# EAGLE design watch_rev3 (EAGLE 6.5.0)
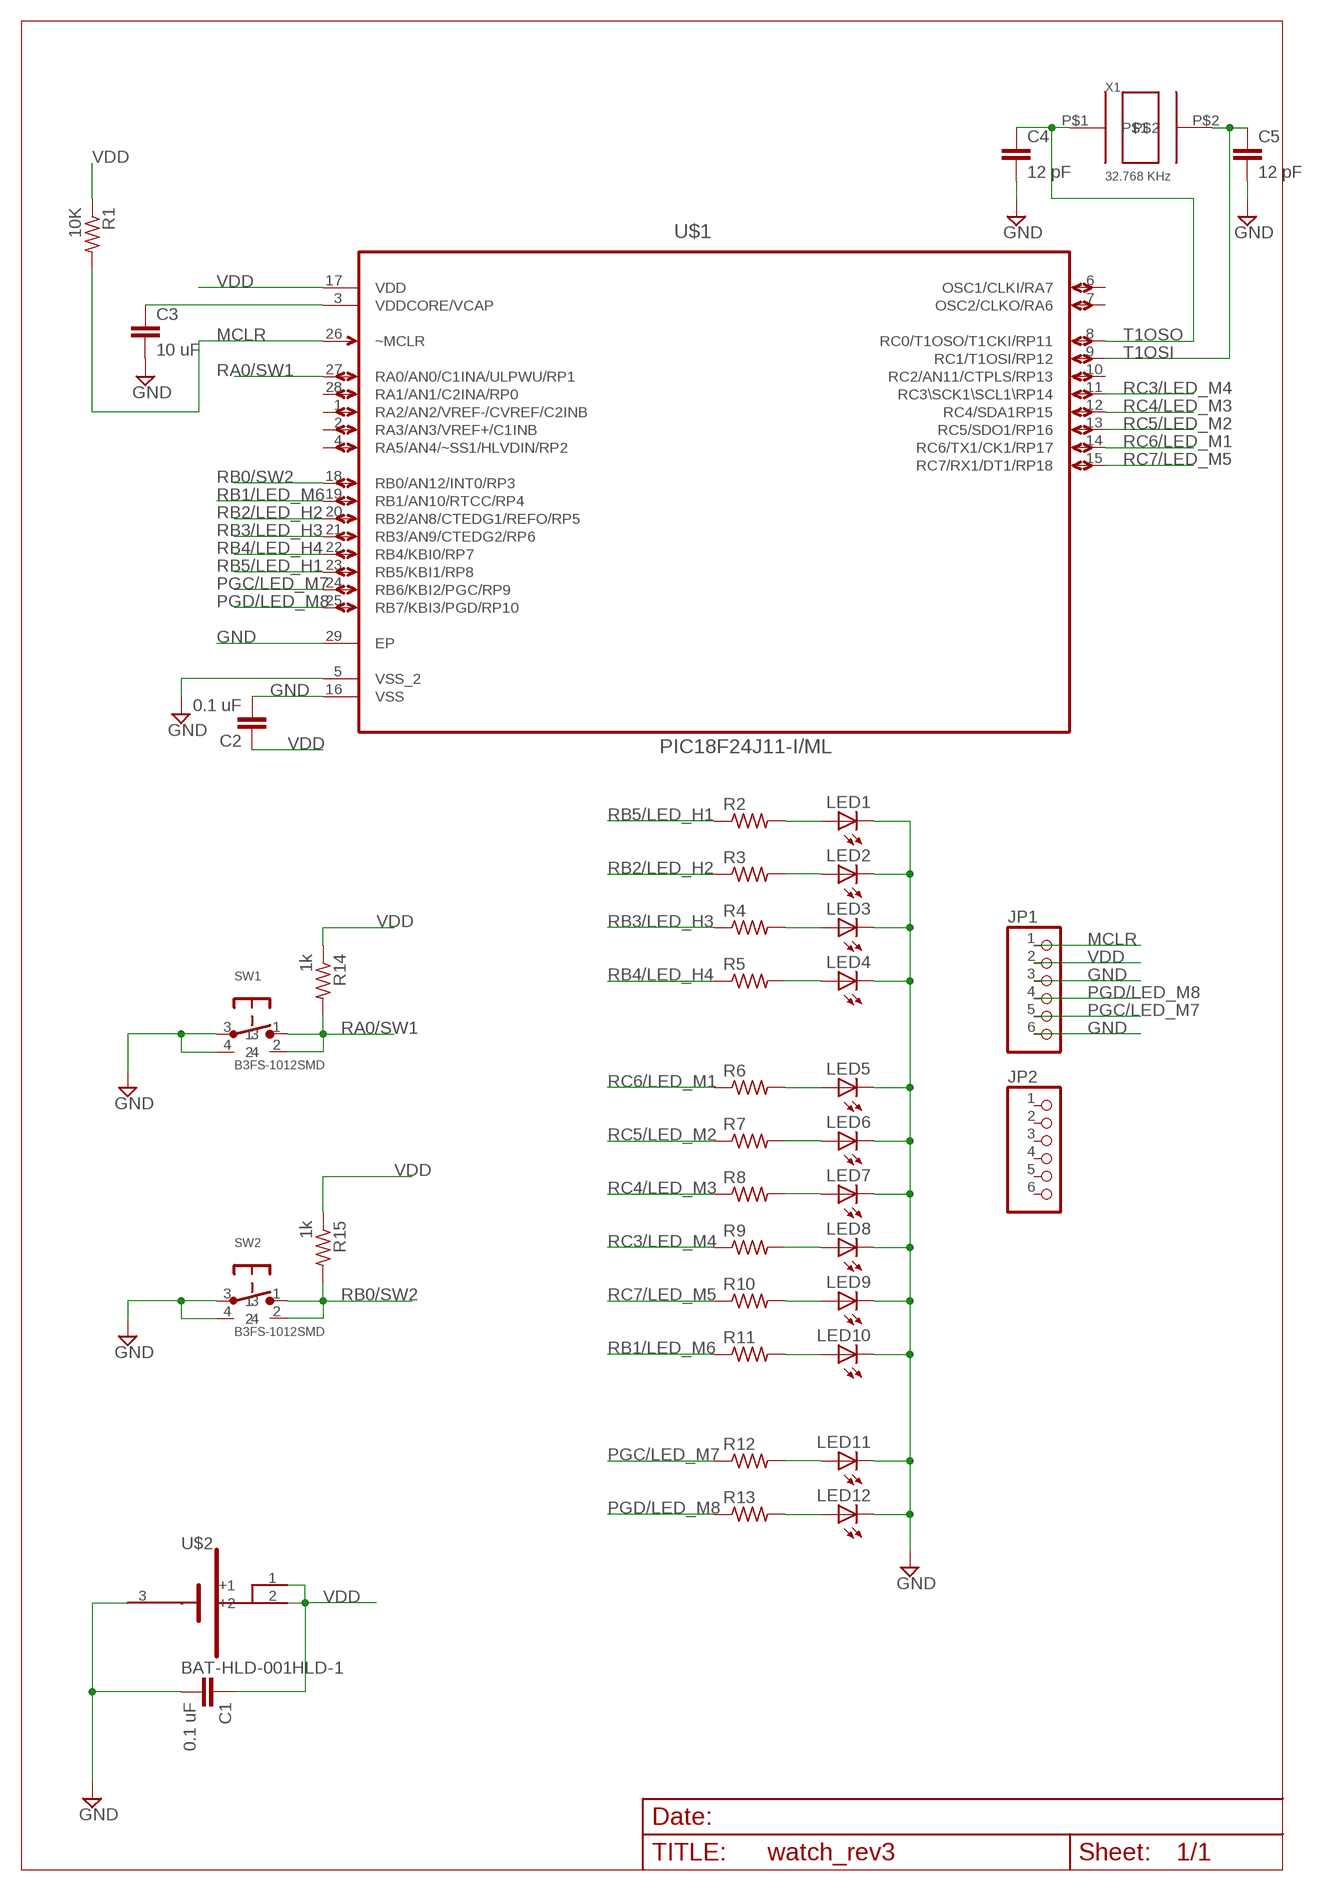
[diagram p0: schematic, sheet 1]

## Parts
C1  0.1 uF  C-EUC0603  [C0603]
C2  0.1 uF  C-EUC0603  [C0603]
C3  10 uF  C-EUC0603  [C0603]
C4  12 pF  C-EUC0603  [C0603]
C5  12 pF  C-EUC0603  [C0603]
JP1  PINHD-1X6  [1X06]
JP2  PINHD-1X6  [1X06]
LED1  LEDCHIPLED_0603  [CHIPLED_0603]
LED2  LEDCHIPLED_0603  [CHIPLED_0603]
LED3  LEDCHIPLED_0603  [CHIPLED_0603]
LED4  LEDCHIPLED_0603  [CHIPLED_0603]
LED5  LEDCHIPLED_0603  [CHIPLED_0603]
LED6  LEDCHIPLED_0603  [CHIPLED_0603]
LED7  LEDCHIPLED_0603  [CHIPLED_0603]
LED8  LEDCHIPLED_0603  [CHIPLED_0603]
LED9  LEDCHIPLED_0603  [CHIPLED_0603]
LED10  LEDCHIPLED_0603  [CHIPLED_0603]
LED11  LEDCHIPLED_0603  [CHIPLED_0603]
LED12  LEDCHIPLED_0603  [CHIPLED_0603]
R1  10K  R-US_R0603  [R0603]
R2  R-US_R0603  [R0603]
R3  R-US_R0603  [R0603]
R4  R-US_R0603  [R0603]
R5  R-US_R0603  [R0603]
R6  R-US_R0603  [R0603]
R7  R-US_R0603  [R0603]
R8  R-US_R0603  [R0603]
R9  R-US_R0603  [R0603]
R10  R-US_R0603  [R0603]
R11  R-US_R0603  [R0603]
R12  R-US_R0603  [R0603]
R13  R-US_R0603  [R0603]
R14  1k  R-US_R0603  [R0603]
R15  1k  R-US_R0603  [R0603]
SW1  B3FS-1012SMD  [B3FS-1012]
SW2  B3FS-1012SMD  [B3FS-1012]
U$1  PIC18F24J11-I/ML  [QFN65P600X600X100-29N]
U$2  BAT-HLD-001HLD-1  [BAT-HLD-001]
X1  32.768 KHz  ST3215SB32768E0HPWBB  [XTAL_3.2X1.5]

## Nets
GND: C1.2 C2.2 C3.2 C4.2 C5.2 JP1.3 JP1.6 LED1.C LED2.C LED3.C LED4.C LED5.C LED6.C LED7.C LED8.C LED9.C LED10.C LED11.C LED12.C SW1.3 SW1.4 SW2.3 SW2.4 U$1.5(VSS_2) U$1.16(VSS) U$1.29(EP) U$2.3(-)
MCLR: JP1.1 R1.2 U$1.26(~MCLR)
N$2: LED1.A R2.2
N$3: LED2.A R3.2
N$4: C3.1 U$1.3(VDDCORE/VCAP)
N$6: LED3.A R4.2
N$7: LED4.A R5.2
N$8: LED5.A R6.2
N$9: LED6.A R7.2
N$10: LED7.A R8.2
N$11: LED8.A R9.2
N$12: LED9.A R10.2
N$13: LED10.A R11.2
N$14: LED11.A R12.2
N$15: LED12.A R13.2
PGC/LED_M7: JP1.5 R12.1 U$1.24(RB6/KBI2/PGC/RP9)
PGD/LED_M8: JP1.4 R13.1 U$1.25(RB7/KBI3/PGD/RP10)
RA0/SW1: R14.2 SW1.1 SW1.2 U$1.27(RA0/AN0/C1INA/ULPWU/RP1)
RB0/SW2: R15.2 SW2.1 SW2.2 U$1.18(RB0/AN12/INT0/RP3)
RB1/LED_M6: R11.1 U$1.19(RB1/AN10/RTCC/RP4)
RB2/LED_H2: R3.1 U$1.20(RB2/AN8/CTEDG1/REFO/RP5)
RB3/LED_H3: R4.1 U$1.21(RB3/AN9/CTEDG2/RP6)
RB4/LED_H4: R5.1 U$1.22(RB4/KBI0/RP7)
RB5/LED_H1: R2.1 U$1.23(RB5/KBI1/RP8)
RC3/LED_M4: R9.1 U$1.11(RC3\SCK1\SCL1\RP14)
RC4/LED_M3: R8.1 U$1.12(RC4/SDA1RP15)
RC5/LED_M2: R7.1 U$1.13(RC5/SDO1/RP16)
RC6/LED_M1: R6.1 U$1.14(RC6/TX1/CK1/RP17)
RC7/LED_M5: R10.1 U$1.15(RC7/RX1/DT1/RP18)
T1OSI: C5.1 U$1.9(RC1/T1OSI/RP12) X1.P$2
T1OSO: C4.1 U$1.8(RC0/T1OSO/T1CKI/RP11) X1.P$1
VDD: C1.1 C2.1 JP1.2 R1.1 R14.1 R15.1 U$1.17(VDD) U$2.1(+1) U$2.2(+2)
Unconnected: JP2.1 JP2.2 JP2.3 JP2.4 JP2.5 JP2.6 U$1.1(RA2/AN2/VREF-/CVREF/C2INB) U$1.2(RA3/AN3/VREF+/C1INB) U$1.4(RA5/AN4/~SS1/HLVDIN/RP2) U$1.6(OSC1/CLKI/RA7) U$1.7(OSC2/CLKO/RA6) U$1.10(RC2/AN11/CTPLS/RP13) U$1.28(RA1/AN1/C2INA/RP0)

## Library data of the parts
C1-C5 = resistor:C-EU: CAPACITOR, European symbol
JP1 JP2 = pinhead:PINHD-1X6: PIN HEADER
LED1-LED12 = led:LED: LED OSRAM: - CHIPLED LG R971, LG N971, LY N971, LG Q971, LY Q971, LO R971, LY R971 LH N974, LH R974 LS Q976, LO Q976, LY Q976 LO Q996 - Hyper CHIPLED LW Q18S LB Q993, LB Q99A, LB R99A - SideLED LS A670, LO A670, LY A670, LG A670, LP A670 LB A673, LV A673, LT A673, LW A673 LH A674 LY A675 LS A676, LA A676, LO A676, LY A676, LW A676 LS A679, LY A679, LG A679 - Hyper Micro SIDELED® LS Y876, LA Y876, LO Y876, LY Y876 LT Y87S - SmartLED LW L88C, LW L88S LB L89C, LB L89S, LG L890 LS L89K, LO L89K, LY L89K LS L896, LA L896, LO L896, LY L896 - TOPLED LS T670, LO T670, LY T670, LG T670, LP T670 LSG T670, LSP T670, LSY T670, LOP T670, LYG T670 LG T671, LOG T671, LSG T671 LB T673, LV T673, LT T673, LW T673 LH T674 LS T676, LA T676, LO T676, LY T676, LB T676, LH T676, LSB T676, LW T676 LB T67C, LV T67C, LT T67C, LS T67K, LO T67K, LY T67K, LW E67C LS E67B, LA E67B, LO E67B, LY E67B, LB E67C, LV E67C, LT E67C LW T67C LS T679, LY T679, LG T679 LS T770, LO T770, LY T770, LG T770, LP T770 LB T773, LV T773, LT T773, LW T773 LH T774 LS E675, LA E675, LY E675, LS T675 LS T776, LA T776, LO T776, LY T776, LB T776 LHGB T686 LT T68C, LB T68C - Hyper Mini TOPLED® LB M676 - Mini TOPLED Santana® LG M470 LS M47K, LO M47K, LY M47K Source: http://www.osram.convergy.de LUXEON: - LUMILED® LXK2-PW12-R00, LXK2-PW12-S00, LXK2-PW14-U00, LXK2-PW14-V00 LXK2-PM12-R00, LXK2-PM12-S00, LXK2-PM14-U00 LXK2-PE12-Q00, LXK2-PE12-R00, LXK2-PE12-S00, LXK2-PE14-T00, LXK2-PE14-U00 LXK2-PB12-K00, LXK2-PB12-L00, LXK2-PB12-M00, LXK2-PB14-N00, LXK2-PB14-P00, LXK2-PB14-Q00 LXK2-PR12-L00, LXK2-PR12-M00, LXK2-PR14-Q00, LXK2-PR14-R00 LXK2-PD12-Q00, LXK2-PD12-R00, LXK2-PD12-S00 LXK2-PH12-R00, LXK2-PH12-S00 LXK2-PL12-P00, LXK2-PL12-Q00, LXK2-PL12-R00 Source: www.luxeon.com KINGBRIGHT: KA-3528ASYC Source: www.kingbright.com
R1-R15 = resistor:R-US_: RESISTOR, American symbol
SW1 SW2 = pic18f24j11:B3FS-1012
U$1 = pic18f24j11:PIC18F24J11-I/ML: 8BIT MCU; DESCRIPTION: 8BIT MCU; MPN: PIC18F24J11-I/Ml; OC_FARNELL: 1707634; OC_NEWARK: 98M1764; PACKAGE: QFN-28; SUPPLIER: Microchip
U$2 = pic18f24j11:BAT-HLD-001
X1 = xtal:ST3215SB32768E0HPWBB

## Board
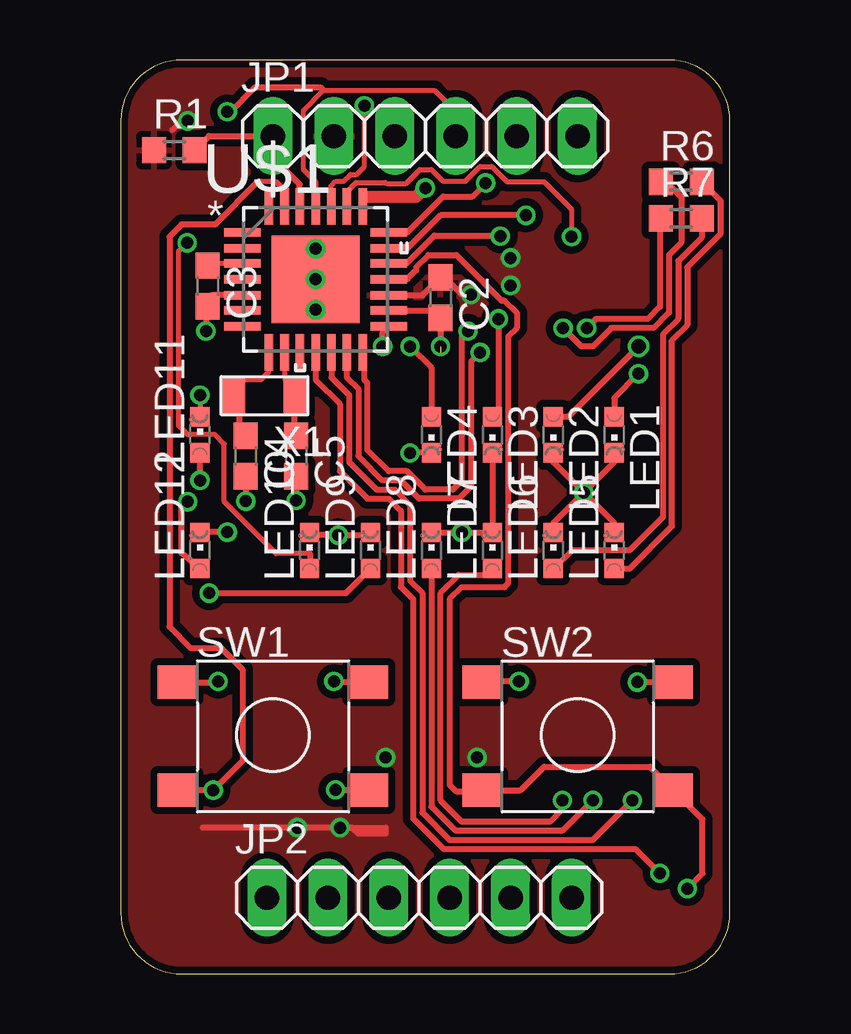
[diagram p1: board, top side]
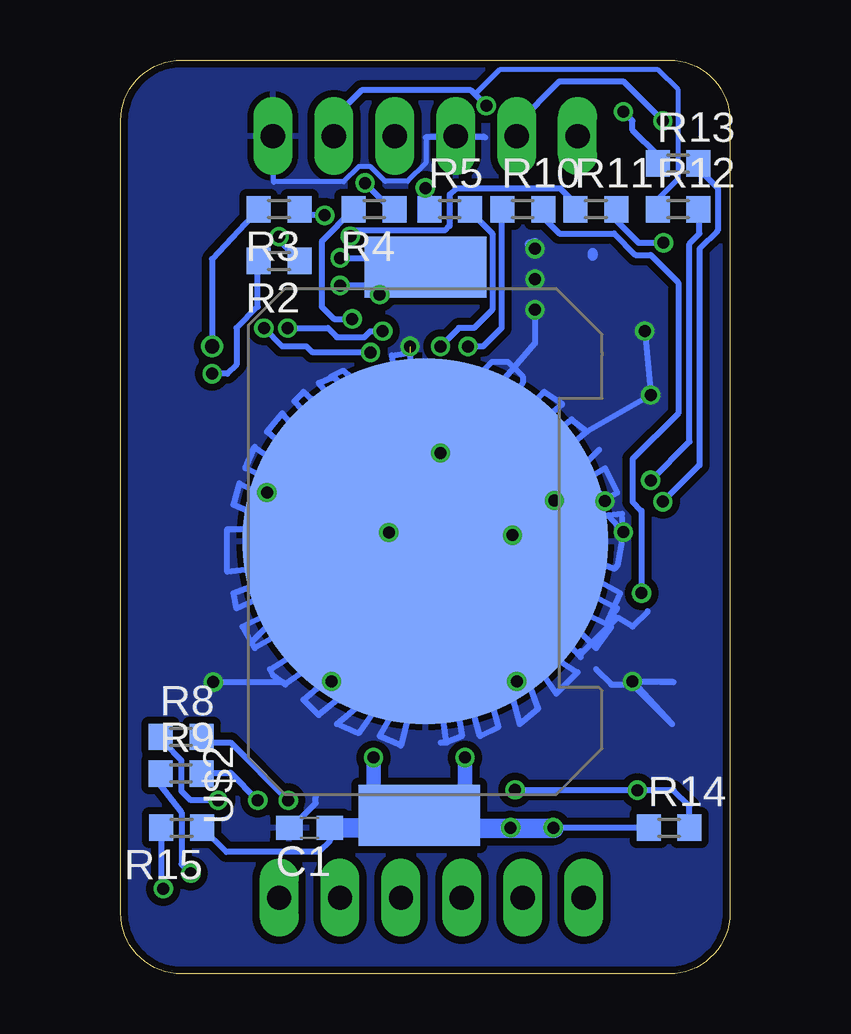
[diagram p2: board, bottom side, seen from below]

Size 25.4 x 38.1 mm. Coordinates in mm from the lower left corner, seen from the top.
Outline: 2.54,0 22.86,0 arc90 25.4,2.54 25.4,35.56 arc90 22.86,38.1 2.54,38.1 arc90 0,35.56 0,2.54 arc90 2.54,0
Copper layers (1*16): Top 0.035mm / dielectric 1.5mm / Bottom 0.035mm
Design rules "dirt_cheap_dirty_boards.v1 *": minimum track width 8mil, minimum drill 12mil, track to track 5mil, track to pad 5mil, pad to pad 5mil, via to via 5mil, smd to smd 0mil, copper to edge 10mil, drill to drill 10mil, minimum pad ring 12mil, minimum via ring 6mil, stop-mask expansion 2mil, vias tented up to drill 25mil, thermal gap 10mil

### Footprints (pad centres in the part's own frame; a part is rotated, then mirrored left to right if it is on the bottom)
C0603 = smd 1.1 x 1: 1 -0.85,0; 2 0.85,0
1X06 = drill 1.016 long: 1 -6.35,0; 2 -3.81,0; 3 -1.27,0; 4 1.27,0; 5 3.81,0; 6 6.35,0
CHIPLED_0603 = smd 0.8 x 0.8: A 0,-0.75; C 0,0.75
R0603 = smd 1 x 1.1: 1 -0.85,0; 2 0.85,0
B3FS-1012 = smd 1.6 x 1.4: 1 4,-2.25; 2 -4,-2.25; 3 4,2.25; 4 -4,2.25
QFN65P600X600X100-29N = smd 1.524 x 0.356: 1 -3.048,1.956; 2 -3.048,1.295; 3 -3.048,0.66; 4 -3.048,0; 5 -3.048,-0.66; 6 -3.048,-1.295; 7 -3.048,-1.956; 15 3.048,-1.956; 16 3.048,-1.295; 17 3.048,-0.66; 18 3.048,0; 19 3.048,0.66; 20 3.048,1.295; 21 3.048,1.956 | smd 0.356 x 1.524: 8 -1.956,-3.048; 9 -1.295,-3.048; 10 -0.66,-3.048; 11 0,-3.048; 12 0.66,-3.048; 13 1.295,-3.048; 14 1.956,-3.048; 22 1.956,3.048; 23 1.295,3.048; 24 0.66,3.048; 25 0,3.048; 26 -0.66,3.048; 27 -1.295,3.048; 28 -1.956,3.048 | smd 3.658 x 3.658: 29 0,0
BAT-HLD-001 = smd 2.54 x 5.08: 1 -11.43,0.254; 2 11.43,0 | smd 15.24 x 15.24: 3 0,0
XTAL_3.2X1.5 = smd 1 x 1.55: P$1 1.3,0; P$2 -1.3,0

### Placement (x,y rotation side)
C1  17.53,6.1 180 bottom
C2  13.34,28.19 270 top
C3  3.63,28.68 270 top
C4  5.21,21.59 270 top
C5  7.32,21.59 270 top
JP1  12.7,34.92 0 top
JP2  12.45,3.17 0 top
LED1  20.57,22.48 180 top
LED2  18.03,22.48 180 top
LED3  15.49,22.48 180 top
LED4  12.95,22.48 180 top
LED5  20.57,17.65 0 top
LED6  18.03,17.65 0 top
LED7  15.49,17.65 0 top
LED8  12.95,17.65 0 top
LED9  10.41,17.65 0 top
LED10  7.87,17.65 0 top
LED11  3.3,22.48 0 top
LED12  3.3,17.65 0 top
R1  2.24,34.34 0 top
R2  18.8,29.72 180 bottom
R3  18.8,31.88 180 bottom
R4  14.83,31.88 180 bottom
R5  11.68,31.88 0 bottom
R6  23.37,33.02 0 top
R7  23.37,31.5 0 top
R8  22.89,9.88 0 bottom
R9  22.89,8.36 0 bottom
R10  8.64,31.88 0 bottom
R11  5.59,31.88 0 bottom
R12  2.16,31.88 0 bottom
R13  2.16,33.78 0 bottom
R14  2.54,6.1 0 bottom
R15  22.86,6.1 180 bottom
SW1  6.35,9.91 0 top
SW2  19.05,9.91 0 top
U$1  8.13,28.96 0 top
U$2  12.7,18.03 90 bottom
X1  5.99,24.1 180 top

### Tracks (layer width: path | path; a pad name or v marks a point on that pad's centre or on a via)
GND  (via drill 0.5, 0.5 pad 0.3)  (1 unrouted)
  Top 0.203: U$1.5 3.72,28.3 C3.2 | v3.3,24.13 LED11.C
  Top 0.254: U$1.16 13.14,27.66 C2.2 v13.34,26.16 | v8.13,30.23 U$1.29 | v16.61,12.19 15.09,12.19 SW2.4 | v21.54,12.17 SW2.3 | LED8.C v14.22,18.4 LED7.C LED3.C | LED5.C 20.57,18.8 v19.3,20.07 | LED1.C 20.57,21.34 v19.3,20.07 | LED6.C 18.03,18.8 v19.3,20.07 | LED2.C 18.03,21.34 v19.3,20.07 | LED4.C 12.08,21.73 v12.06,21.72 | LED9.C 10.38,18.4 | 10.4,18.29 LED9.C | 3.16,18.4 LED12.C 3.31,18.41 v4.45,18.41 | SW1.4 4.03,12.16 v4.06,12.19 | SW1.3 8.93,12.16 v8.89,12.19 | U$1.5 3.79,28.3 3.56,28.07 v3.56,26.8 | 7.86,18.41 LED10.C 7.99,18.29 v9.07,18.29 10.3,18.29 LED9.C | C5.2 v7.32,19.74 | C4.2 5.21,19.74 v5.21,19.71
  Bottom 0.203: 10.26,34.92 10.21,34.87 | 12.68,34.87 12.68,33.81 13.44,33.05 14.38,33.05 14.99,33.66 15.47,33.66 16.1,33.02 19,33.02 19.02,32.99 19.02,34.9 JP1.6
  Bottom 0.254: 6.35,21.21 6.1,21.21 5.46,21.84 | 6.22,13.34 6.22,13.21 7.62,14.61 | 6.22,13.34 6.22,13.46 | 7.87,17.54 7.87,14.86 7.62,14.61 | C1.2 18.29,6.1 17.27,7.11 17.27,7.37 | 19.94,13.84 19.18,14.61 18.92,14.61 16.61,12.29 v16.61,12.19 | 5.59,12.7 4.95,12.06 4.06,12.06 2.41,10.41 4.06,12.22 SW1.4 2.39,12.19 v4.06,12.19 | 3.43,15.11 4.06,14.48 4.7,14.86 6.22,13.34 | v21.54,12.17 18.64,12.17 | 7.62,14.61 8.51,13.72 8.51,12.19 9.31,12.16 SW1.3 10.31,12.19 v8.89,12.19 | 15.49,19.93 15.49,19.04 | 15.49,22.36 15.49,19.93 | 15.49,19.93 v14.22,18.4 | U$2.3 12.97,17.78 13.28,18.09 | 13.28,18.09 v14.22,18.4 | v19.3,20.07 15.63,20.45 v14.22,18.4 | 12.06,19.93 v12.06,21.72 8.13,26.29 v8.13,27.69 | 12.06,19.93 12.95,19.04 12.95,18.41 13.28,18.09 | 10.54,24.77 10.54,24.89 9.91,25.53 9.27,25.53 8.64,24.89 8.64,24.64 9.27,24 7.24,22.61 6.6,23.11 5.97,22.61 | 5.97,22.61 6.73,21.97 6.1,20.57 5.21,21.08 4.7,20.07 v5.21,19.71 | v5.21,19.71 5.84,19.94 5.76,19.64 | 5.76,19.64 5.7,19.45 | 5.7,19.45 5.59,19.05 5.07,19.11 | 5.07,19.11 v4.45,18.41 | v4.45,18.41 4.7,17.02 4.83,16.89 5.59,17.14 5.71,16.51 4.57,15.88 5.08,14.73 4.7,15.24 5.97,15.88 6.22,15.11 4.95,14.48 5.59,13.59 6.48,14.48 7.37,13.21 6.35,12.57 7.24,11.68 7.75,12.45 8.38,12.06 8,11.05 8.76,10.41 9.02,11.43 9.91,11.18 9.65,10.29 10.41,9.91 10.67,10.79 11.3,10.67 11.18,9.91 11.81,9.65 | 12.06,9.65 11.81,9.65 | 11.81,9.65 11.94,10.54 13.46,10.54 13.72,9.53 14.61,9.91 14.1,10.79 14.86,10.92 15.49,10.03 16.38,10.41 15.49,11.18 16.38,11.43 17.14,10.79 17.78,11.43 17.02,12.06 17.65,12.7 18.54,12.06 19.05,12.45 19.18,12.7 18.16,13.34 18.92,14.1 19.81,13.59 20.32,14.48 19.3,14.99 19.68,15.62 20.57,15.24 20.7,15.88 19.68,16.26 19.81,16.89 20.95,16.76 20.95,18.54 19.94,18.54 19.81,19.18 20.7,19.56 20.45,20.45 19.43,19.94 19.18,20.57 20.19,21.08 19.81,21.97 18.92,21.34 18.41,21.84 19.3,22.61 18.67,23.37 17.91,22.48 17.4,22.99 18.16,23.88 17.78,24.26 16.89,23.5 16.51,23.88 17.14,24.64 16.51,24.89 16,24.26 15.37,24.51 16.13,25.15 16.64,24.89 16.38,24.77 16.13,24.51 13.97,25.02 14.1,25.78 13.34,25.91 13.34,25.15 13.21,24.89
  Bottom 0.254: 10.21,34.87 12.68,34.87 | 7.87,17.54 6.62,17.54 6.6,17.53 7.86,17.53 7.87,17.54 | v9.07,18.29 11.19,19.05 12.06,19.93 | 5.7,19.45 6.11,19.05 6.87,19.81 v7.32,19.74 | v4.45,18.41 4.5,19.18 5.07,19.11 | 5.97,22.61 v3.3,24.13 v3.56,26.8 | 7.75,23.11 6.99,23.75 7.75,24.26 8.38,23.62 | v5.21,19.71 5.38,20.01 5.76,19.64
  Bottom 0.406: v8.13,30.23 8.13,30.48 8.36,30.4 | 5.73,30.06 5.71,29.93
  other vias: 8.13,28.96
  pour Bottom (isolate 0.305): 2.54,38.1 22.86,38.1 arc-90 25.4,35.56 25.4,2.54 arc-90 22.86,0 2.54,0 arc-90 0,2.54 0,35.56 arc-90
MCLR
  Top 0.254: U$1.26 7.47,32.92 6.35,34.04 JP1.1 3.68,34.92 3.43,34.67 3.43,34.54 3.1,34.21 R1.2
N$2  (via drill 0.5 pad 0.3)
  Top 0.254: v21.59,25.02 20.57,24 LED1.A
  Bottom 0.254: R2.2 19.68,29.68 19.68,27.81 20.57,26.92 20.57,25.4 20.95,25.02 v21.59,25.02
N$3  (via drill 0.6 pad 0.3)
  Top 0.254: LED2.A 18.66,23.23 v21.59,26.16
  Bottom 0.254: R3.2 21.59,29.81 v21.59,26.16
N$4
  Top 0.203: U$1.3 3.34,29.62 C3.1
N$6  (via drill 0.5 pad 0.3)
  Top 0.254: v15.75,27.3 15.75,23.36 LED3.A
  Bottom 0.254: v15.75,27.3 16.51,27.3 17.02,27.81 17.02,30.52 R4.2 15.68,31.81
N$7  (via drill 0.5 pad 0.3)
  Top 0.254: v12.06,26.16 12.95,25.27 LED4.A
  Bottom 0.254: R5.2 10.83,31.79 9.91,30.86 9.91,27.69 10.67,26.92 11.3,26.92 v12.06,26.16
N$8
  Top 0.254: R6.2 25.02,32.22 25.02,30.86 23.62,29.46 23.62,27.05 22.99,26.42 22.99,18.67 21.21,16.89 20.59,16.89 LED5.A
N$9
  Top 0.254: R7.2 24.22,30.7 23.24,29.72 23.24,27.3 22.61,26.67 22.61,19.05 21.21,17.65 18.81,17.65 LED6.A
N$10  (via drill 0.5 pad 0.3)
  Top 0.254: v18.41,7.24 18.41,6.86 17.91,6.35 14.22,6.35 13.34,7.24 13.34,15.88 14.1,16.64 15.36,16.64 LED7.A
  Bottom 0.254: R8.2 22.01,9.65 20.83,9.65 v18.41,7.24
N$11  (via drill 0.5 pad 0.3)
  Top 0.254: LED8.A 12.95,6.99 13.97,5.97 18.41,5.97 v19.68,7.24
  Bottom 0.254: R9.2 22.01,8.38 20.83,8.38 v19.68,7.24
N$12  (via drill 0.5)
  Top 0.254: LED9.A 9.39,15.88 v3.68,15.88
  Bottom 0.254: R10.2 7.75,31.96 7.75,31.5 7.11,30.86 4.83,30.86 3.94,29.97 3.3,29.97 2.16,28.83 2.16,23.37 4.06,21.46 4.06,19.68 3.68,19.3 v3.68,15.88
N$13  (via drill 0.5)
  Top 0.203: 7.89,17.53 6.48,17.53 4.32,19.68 4.32,22.1 3.94,22.48 2.79,22.48 2.41,22.86 2.41,30.12 v2.77,30.48 2.49,30.2
  Top 0.254: 7.89,17.53 LED10.A
  Bottom 0.254: R11.2 4.74,31.41 3.81,30.48 v2.77,30.48
N$14  (via drill 0.5 pad 0.3)
  Top 0.254: 3.42,21.72 LED11.A v3.3,20.57
  Bottom 0.254: v3.3,20.57 1.69,22.19 1.69,30.44 1.27,30.86 1.27,31.71 R12.2
N$15  (via drill 0.5 pad 0.3)
  Top 0.254: LED12.A 2.54,17.54 2.54,19.43 v2.79,19.68
  Bottom 0.254: R13.2 1.52,33.78 0.51,32.77 0.51,30.99 1.27,30.23 1.27,21.21 v2.79,19.68
PGC/LED_M7  (via drill 0.5 pad 0.3)
  Top 0.203: v10.16,36.2 10.16,33.66 9.83,33.33 9.58,33.33 9.3,33.05 8.97,33.05 8.76,32.84 8.76,32.64 8.79,32.54 U$1.24
  Bottom 0.203: R12.1 3.39,32.17 3.14,32.17 2.16,33.15 2.16,36.85 3,37.69 9.6,37.69 10.63,36.66
  Bottom 0.254: v10.16,36.2 10.63,36.66 10.79,36.83 15.37,36.83 16.51,35.69 JP1.5
PGD/LED_M8  (via drill 0.5)
  Top 0.203: 13.97,35.94 13.08,36.83 8.46,36.83 7.62,35.99 7.62,33.53 8.13,33.02 U$1.25
  Top 0.254: 13.97,35.94 JP1.4 | v4.45,35.94 4.57,35.94 5.59,36.96 8.33,36.96 8.46,36.83
  Bottom 0.254: v4.45,35.94 4.06,35.56 4.06,35.18 3.01,34.12 R13.1
RA0/SW1  (via drill 0.5)
  Top 0.203: U$1.27 6.83,32.66 6.48,33.02 5.74,33.02 | 1.97,7.28 SW1.2
  Top 0.254: SW1.2 v3.86,7.66 5.08,8.88 5.08,12.7 4.19,13.59 2.92,13.59 2.03,14.48 2.03,30.73 2.54,31.24 3.94,31.24 5.71,33.02 5.74,33.02 | SW1.1 8.97,7.66 v8.95,7.67
  Bottom 0.254: R14.2 1.69,7 SW1.2 v3.86,7.66 3.88,7.67 v8.95,7.67
RB0/SW2  (via drill 0.5 pad 0.3)
  Top 0.203: 11.84,28.98 11.2,28.98 U$1.18
  Top 0.254: v23.62,3.56 24.26,4.19 24.26,6.45 SW2.1 22.07,8.64 17.65,8.64 16.67,7.66 SW2.2 | 14.99,7.72 SW2.2 | 11.84,28.98 11.96,28.98 12.32,29.34 12.32,29.46 12.83,29.97 13.99,29.97 15.06,28.91 15.19,28.75 15.88,28.07 16,28.07 16.51,27.56 16.51,26.92 16.15,26.57 16.15,16.28 16,16.13 14.22,16.13 13.72,15.62 13.72,7.87 13.97,7.62 15.01,7.62 SW2.2
  Bottom 0.254: R15.2 23.71,3.64 v23.62,3.56
RB1/LED_M6  (via drill 0.5)
  Top 0.254: U$1.19 11.91,29.62 13.08,30.79 15.85,30.79 v15.82,30.76
  Bottom 0.254: 6.4,31.71 R11.1 6.44,32.12 7.06,32.74 11.43,32.74 11.68,32.49 11.68,31.19 11.89,30.99 15.6,30.99 v15.82,30.76 15.75,30.84
RB2/LED_H2  (via drill 0.5 pad 0.3)
  Top 0.254: v16.89,31.62 13.34,31.62 11.94,30.23 11.2,30.23 U$1.20
  Bottom 0.254: 17.91,31.71 R3.1 17.69,31.62 v16.89,31.62
RB3/LED_H3  (via drill 0.5 pad 0.3)
  Top 0.254: U$1.21 11.94,30.91 13.44,32.41 14.66,32.41 v15.21,32.97
  Bottom 0.254: R4.1 14.3,31.85 14.3,32.05 v15.21,32.97
RB4/LED_H4  (via drill 0.5 pad 0.3)
  Top 0.254: 10.16,32.38 10.03,32.05 U$1.22
  Top 0.508: v12.7,32.77 12.32,32.38 10.16,32.38
  Bottom 0.254: R5.1 12.53,32.6 v12.7,32.77
RB5/LED_H1  (via drill 0.5 pad 0.3)
  Top 0.203: v18.8,30.73 18.8,31.88 17.65,33.02 16.1,33.02 15.47,33.66 14.99,33.66 14.38,33.05 13.44,33.05 12.95,33.53 12.47,33.53 11.89,32.94 11.07,32.94 11.02,32.99 9.8,32.99 9.45,32.64 U$1.23
  Bottom 0.203: v18.8,30.73 18.8,30.57 R2.1
RC3/LED_M4  (via drill 0.5 pad 0.3)
  Top 0.254: U$1.11 8.13,24.77 9.14,23.75 9.14,20.95 10.29,19.81 11.18,19.81 11.68,19.3 11.68,16.13 12.19,15.62 12.19,6.48 13.46,5.21 21.46,5.21 v22.48,4.19
  Bottom 0.254: R9.1 23.75,8.34 23.75,7.87 22.86,6.73 22.86,4.57 v22.48,4.19
RC4/LED_M3  (via drill 0.5 pad 0.3)
  Top 0.254: U$1.12 8.79,24.87 9.53,24.13 9.53,21.34 10.67,20.19 11.43,20.19 12.06,19.56 12.06,16.38 12.57,15.88 12.57,6.73 13.72,5.59 19.68,5.59 v21.34,7.24
  Bottom 0.254: v21.34,7.24 22.48,7.24 22.86,7.62 22.86,8.89 23.6,9.63 R8.1
RC5/LED_M2  (via drill 0.5 pad 0.3)
  Top 0.254: U$1.13 9.42,24.87 9.91,24.38 9.91,21.59 10.92,20.57 11.68,20.57 12.45,19.81 14.1,19.81 14.61,20.32 14.61,25.53 v14.99,25.91 | R7.1 22.48,31.46 22.48,27.81 21.97,27.3 19.81,27.3 v19.43,26.92
  Bottom 0.254: v14.99,25.91 17.4,25.91 17.65,26.16 18.67,26.16 v19.43,26.92
RC6/LED_M1  (via drill 0.5 pad 0.3)
  Top 0.254: R6.1 22.48,33.02 22.48,32.89 22.86,32.89 23.37,32.38 23.37,30.48 22.86,29.97 22.86,27.56 22.23,26.92 20.45,26.92 19.68,26.16 19.2,26.16 v18.44,26.92 | U$1.14 10.16,25.86 10.16,24.77 10.29,24.64 10.29,21.84 11.18,20.95 11.94,20.95 12.7,20.19 13.84,20.19 14.22,20.57 14.22,26.54 v14.48,26.8
  Bottom 0.254: v18.44,26.92 16.76,26.92 16.38,26.54 15.24,26.54 14.99,26.8 v14.48,26.8
RC7/LED_M5  (via drill 0.5 pad 0.3)
  Top 0.254: 11.23,27.05 U$1.15 10.92,26.75 v10.92,26.16
  Bottom 0.254: R10.1 9.53,31.96 9.53,26.92 10.29,26.16 v10.92,26.16
T1OSI
  Top 0.203: U$1.9 6.86,25.88 6.86,24.77 7.29,24.33 X1.P$2 7.24,24.05 | C5.1 7.06,22.55 7.24,22.73
  Top 0.254: 7.24,22.73 7.24,24.05
T1OSO
  Top 0.203: X1.P$1 4.69,24.43 | U$1.8 6.17,25.09 5.84,24.77 4.95,24.77 4.83,24.64 4.83,24.24 X1.P$1 | C4.1 5.21,22.61 4.95,22.86 | 4.95,23.85 X1.P$1
  Top 0.254: 4.95,22.86 4.95,23.85
VDD  (via drill 0.5 pad 0.3)
  Top 0.254: v9.14,6.1 11.05,6.1 11.05,5.84 9.91,5.84 9.65,6.1 v9.14,6.1 | v9.14,6.1 v7.37,6.1 3.43,6.1 | U$1.17 12.59,28.3 C2.1 | v14.61,28.32 14.22,28.32 13.46,29.08 | v2.79,35.56 2.54,35.56 2.16,35.18
  Bottom 0.254: C1.1 16.68,5.55 17.14,5.08 20.99,5.08 R15.1 | R14.1 v7.37,6.1 | 8.64,6.1 8.76,5.97 9.78,5.97 U$2.1 | 8.64,6.1 v9.14,6.1 12.19,6.1 | 8.64,6.1 v7.37,6.1 | v16.26,28.7 14.73,28.7 14.22,29.21 13.59,29.21 | U$2.2 13.59,29.21 | v16.26,29.84 13.34,29.84 | v14.61,28.32 14.48,28.32 13.59,29.21 | JP1.2 8.89,35.43 7.11,37.21 4.45,37.21 v2.79,35.56 | 7.34,6.07 v7.37,6.1
  Bottom 0.61: v14.86,9.02 14.86,6.99 | v11.05,9.02 11.05,6.86
  Bottom 0.813: C1.1 13.21,6.1 U$2.1 | 10.69,6.07 7.34,6.07
  pour Top (isolate 0.305): 2.54,38.1 22.86,38.1 arc-90 25.4,35.56 25.4,2.54 arc-90 22.86,0 2.54,0 arc-90 0,2.54 0,35.56 arc-90

### Text on the board
tDocu: J1 | R1 | 1 | R6 | U1 | R7 | C3 | C2 | X1 | D | C4 | C5 | C5 | 4 | 1 | T | 32 | 8 | 2 | Blink | D/T | Set | Zzz | 1 | J2
bDocu: R13 | 1 | R11 | R10 | R5 | R4 | R3 | R12 | R2 | R8 | R9 | R14 | C1 | R15 | 1